# EAGLE design ModuleProcessing (EAGLE 9.1.3)
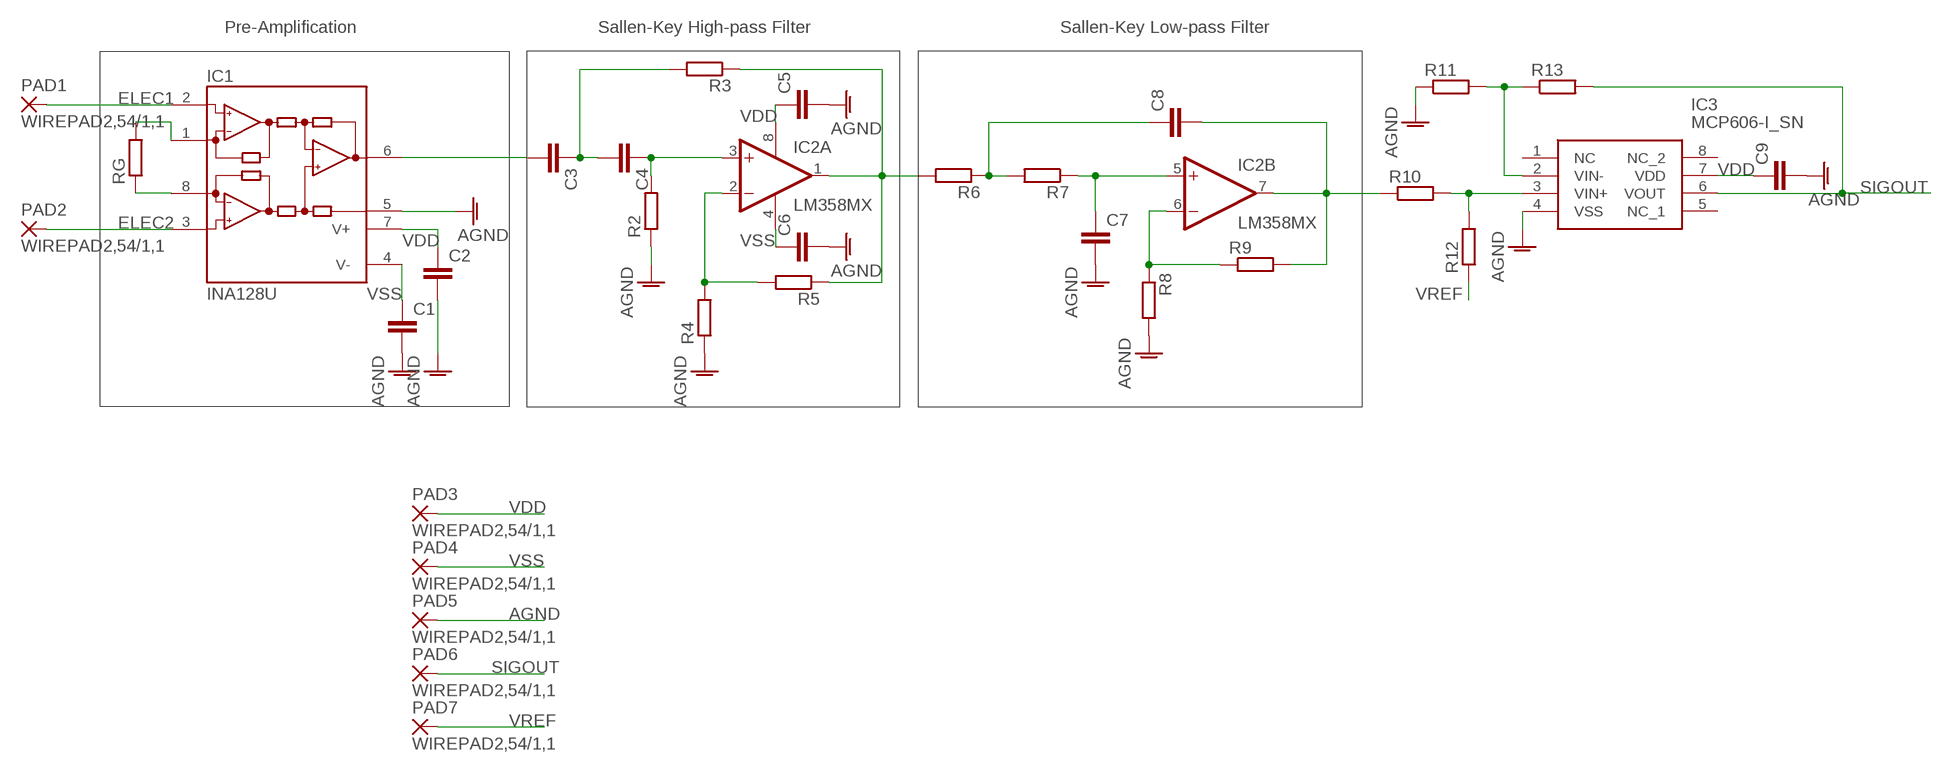
[diagram p0: schematic, sheet 1]

## Parts
C1  C-EUC0603  [C0603]
C2  C-EUC0603  [C0603]
C3  C-EUC0603  [C0603]
C4  C-EUC0603  [C0603]
C5  C-EUC0603  [C0603]
C6  C-EUC0603  [C0603]
C7  C-EUC0603  [C0603]
C8  C-EUC0603  [C0603]
C9  C-EUC0603  [C0603]
IC1  INA128U  [SO08]
IC2  LM358MX  [SO08]
IC3  MCP606-I_SN  [SOIC127P600X175-8N]
PAD1  WIREPAD2,54/1,1  [2,54/1,1]
PAD2  WIREPAD2,54/1,1  [2,54/1,1]
PAD3  WIREPAD2,54/1,1  [2,54/1,1]
PAD4  WIREPAD2,54/1,1  [2,54/1,1]
PAD5  WIREPAD2,54/1,1  [2,54/1,1]
PAD6  WIREPAD2,54/1,1  [2,54/1,1]
PAD7  WIREPAD2,54/1,1  [2,54/1,1]
R2  R-EU_0207/10  [0207/10]
R3  R-EU_0207/10  [0207/10]
R4  R-EU_0207/10  [0207/10]
R5  R-EU_0207/10  [0207/10]
R6  R-EU_0207/10  [0207/10]
R7  R-EU_0207/10  [0207/10]
R8  R-EU_0207/10  [0207/10]
R9  R-EU_0207/10  [0207/10]
R10  R-EU_0207/10  [0207/10]
R11  R-EU_0207/10  [0207/10]
R12  R-EU_0207/10  [0207/10]
R13  R-EU_0207/10  [0207/10]
RG  R-EU_0207/10  [0207/10]

## Nets
AGND: C1.2 C2.2 C5.2 C6.2 C7.2 C9.2 IC1.5(REF) IC3.4(VSS) PAD5.1(P) R2.1 R4.1 R8.2 R11.1
ELEC1: IC1.2(-IN) PAD1.1(P)
ELEC2: IC1.3(+IN) PAD2.1(P)
N$1: IC1.1(RG) RG.2
N$2: IC1.8(RG) RG.1
N$3: IC2.2(A:-IN) R4.2 R5.2
N$4: IC2.1(A:OUT) R3.1 R5.1 R6.2
N$5: C4.1 IC2.3(A:+IN) R2.2
N$6: C3.1 C4.2 R3.2
N$7: C3.2 IC1.6(OUT)
N$8: C8.1 R6.1 R7.2
N$9: C7.1 IC2.5(B:+IN) R7.1
N$10: C8.2 IC2.7(B:OUT) R9.2 R10.1
N$11: IC2.6(B:-IN) R8.1 R9.1
N$12: IC3.3(VIN+) R10.2 R12.2
N$13: IC3.2(VIN-) R11.2 R13.1
SIGOUT: IC3.6(VOUT) PAD6.1(P) R13.2
VDD: C2.1 C5.1 C9.1 IC1.7(V+) IC2.8(P:V+) IC3.7(VDD) PAD3.1(P)
VREF: PAD7.1(P) R12.1
VSS: C1.1 C6.1 IC1.4(V-) IC2.4(P:V-) PAD4.1(P)
Unconnected: IC3.1(NC) IC3.5(NC_1) IC3.8(NC_2)

## Notes on the sheet
- Pre-Amplification | Sallen-Key High-pass Filter | Sallen-Key Low-pass Filter

## Library data of the parts
C1-C9 = rcl:C-EU: CAPACITOR, European symbol; SPICEPREFIX: C
IC1 = burr-brown:INA128: Instrumentation Amplifiers Precision, Low Power; MF: TEXAS INSTRUMENTS; MPN: INA128U; OC_FARNELL: 1212413; OC_NEWARK: 35C1729
IC2 = linear:LM358: OP AMP also LM158; LM258; LM2904 Source: http://cache.national.com/ds/LM/LM158.pdf; SPICEPREFIX: J
IC3 = MCP606-I_SN:MCP606-I_SN: Single 25uA,2.5V Op Amp,MCP606-I/SN Source: Datasheet <http://ww1.microchip.com/downloads/en/DeviceDoc/11177f.pdf>; ALLIED_NUMBER: 70046173; ALLIED_PRICE-STOCK: http://www.alliedelec.com/microchip-technology-inc-mcp606-i-sn/70046173/; ARROW_PART_NUMBER: MCP606-I/SN; ARROW_PRICE-STOCK: https://www.arrow.com/en/products/mcp606-isn/microchip-technology; DESCRIPTION: Single 25uA,2.5V Op Amp,MCP606-I/SN; HEIGHT: 1.75mm; MANUFACTURER_NAME: Microchip; MANUFACTURER_PART_NUMBER: MCP606-I/SN; RS_PART_NUMBER: 0403002P; RS_PRICE-STOCK: http://uk.rs-online.com/web/p/products/0403002P
PAD1-PAD7 = wirepad:WIREPAD: Wire PAD connect wire on PCB
R2-R13 RG = rcl:R-EU_: RESISTOR, European symbol; SPICEPREFIX: R

## Net classes
0 default: width 0.406 mm, drill 0.559 mm, clearance 0.254 mm

## Board
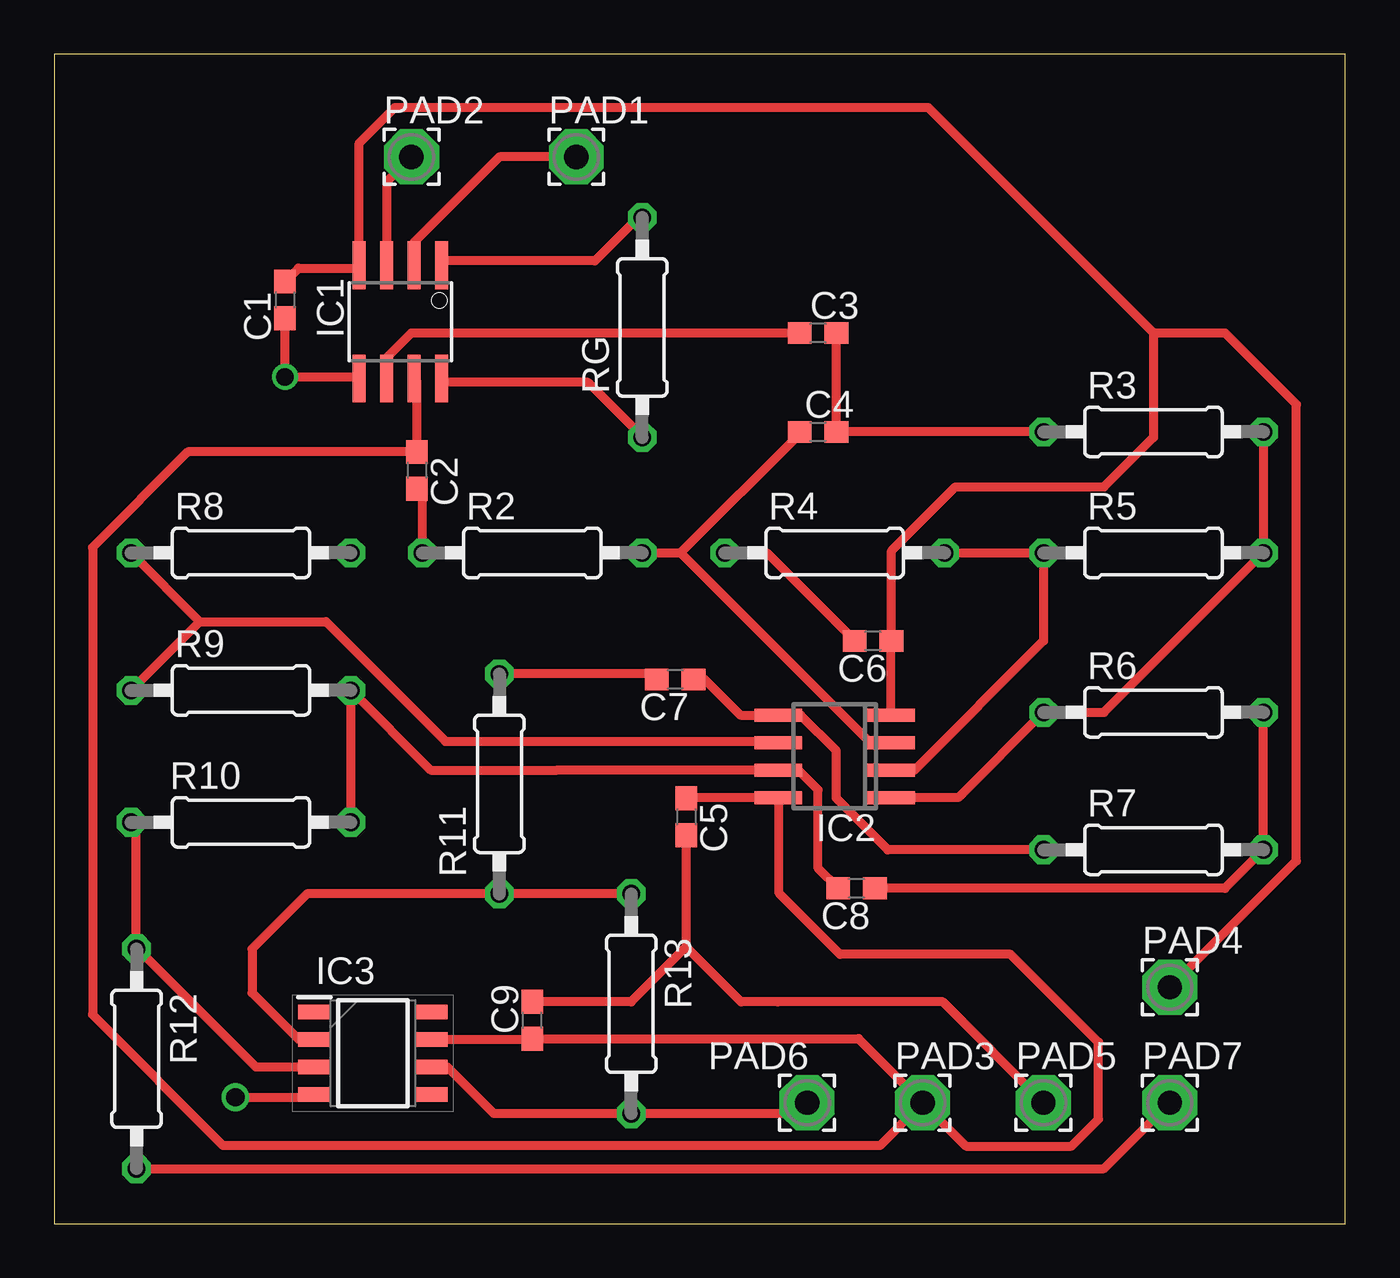
[diagram p1: board, top side]
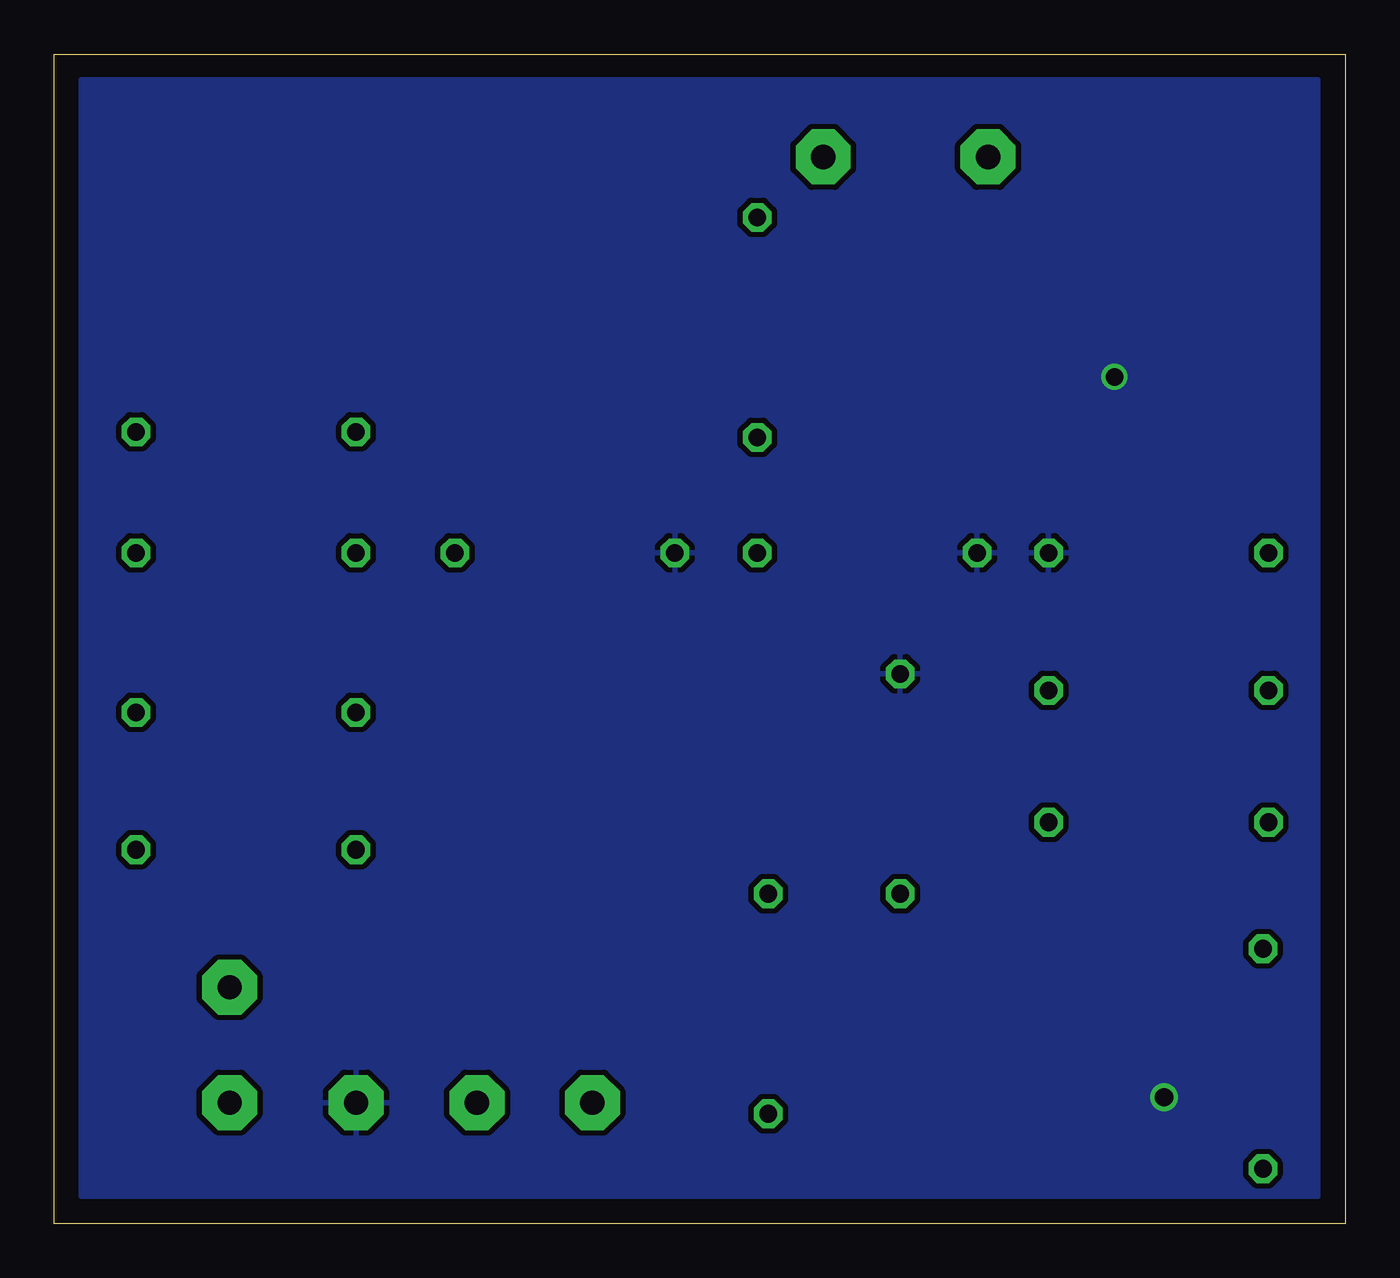
[diagram p2: board, bottom side, seen from below]

Size 59.67 x 54.03 mm. Coordinates in mm from the lower left corner, seen from the top.
Outline: 0,0 59.67,0 59.67,54.03 0,54.03 0,0
Copper layers (1*16): Top 0.035mm / dielectric 1.5mm / Bottom 0.035mm
Design rules "default": minimum track width 6mil, minimum drill 0.35mm, track to track 6mil, track to pad 6mil, pad to pad 6mil, via to via 6mil, smd to smd 6mil, copper to edge 40mil, drill to drill 6mil, minimum pad ring 10mil, minimum via ring 8mil, stop-mask expansion 4mil, vias tented up to drill 0mil, thermal gap 10mil

### Footprints (pad centres in the part's own frame; a part is rotated, then mirrored left to right if it is on the bottom)
C0603 = smd 1.1 x 1: 1 -0.85,0; 2 0.85,0
SO08 = smd 0.61 x 2.21: 1 -1.905,-2.616; 2 -0.635,-2.616; 3 0.635,-2.616; 4 1.905,-2.616; 5 1.905,2.616; 6 0.635,2.616; 7 -0.635,2.616; 8 -1.905,2.616
SO08' = smd 0.6 x 2.2: 1 -1.905,-2.6; 2 -0.635,-2.6; 3 0.635,-2.6; 4 1.905,-2.6; 5 1.905,2.6; 6 0.635,2.6; 7 -0.635,2.6; 8 -1.905,2.6
SOIC127P600X175-8N = smd 1.5 x 0.65: 1 -2.7,1.905; 2 -2.7,0.635; 3 -2.7,-0.635; 4 -2.7,-1.905; 5 2.7,-1.905; 6 2.7,-0.635; 7 2.7,0.635; 8 2.7,1.905
2,54/1,1 = drill 1.118 pad 2.54 octagon: 1 0,0
0207/10 = drill 0.813 octagon: 1 -5.08,0; 2 5.08,0

### Placement (x,y rotation side)
C1  10.67,42.67 270 top
C2  16.76,34.8 270 top
C3  35.31,41.15 180 top
C4  35.31,36.58 0 top
C5  29.21,18.8 270 top
C6  37.85,26.92 180 top
C7  28.7,25.15 180 top
C8  37.08,15.49 180 top
C9  22.1,9.4 90 top
IC1  16,41.66 180 top
IC2  LM358MX  [SO08']  36.07,21.59 90 top
IC3  14.73,7.87 0 top
PAD1  24.13,49.28 0 top
PAD2  16.51,49.28 0 top
PAD3  40.13,5.59 0 top
PAD4  51.56,10.92 0 top
PAD5  45.72,5.59 0 top
PAD6  34.8,5.59 0 top
PAD7  51.56,5.59 0 top
R2  22.1,30.99 0 top
R3  50.8,36.58 180 top
R4  36.07,30.99 0 top
R5  50.8,30.99 180 top
R6  50.8,23.62 180 top
R7  50.8,17.27 0 top
R8  8.64,30.99 0 top
R9  8.64,24.64 0 top
R10  8.64,18.54 180 top
R11  20.57,20.32 270 top
R12  3.81,7.62 90 top
R13  26.67,10.16 270 top
RG  27.18,41.4 90 top

### Tracks (layer width: path | path; a pad name or v marks a point on that pad's centre or on a via)
AGND  (via drill 0.8, 0.85)
  Top 0.406: 12.29,5.92 IC3.4 11.96,5.92 11.89,5.84 v8.38,5.84 | 36.99,26.9 C6.2 32.93,30.99 R4.1 | 27.74,25.17 C7.2 27.6,25.4 R11.1 | 10.69,41.53 C1.2 v10.67,39.12 14.02,39.12 IC1.5 | 13.46,31.01 R8.2 | PAD5.1 41.06,10.25 33.44,10.25 31.75,10.25 29.21,12.79 | C9.2 26.67,10.25 29.21,12.79 | C5.2 29.21,12.79 | R2.1 17.02,33.69 C2.2
  pour Bottom: 1.27,1.27 58.42,1.27 58.42,52.83 1.27,52.83
ELEC1
  Top 0.406: 16.74,44.56 16.74,44.48 IC1.2 16.64,45.34 20.57,49.28 PAD1.1
ELEC2
  Top 0.406: PAD2.1 15.37,48.13 IC1.3
N$1
  Top 0.406: IC1.1 18.06,44.48 24.99,44.48 26.98,46.46 RG.2
N$2
  Top 0.406: IC1.8 18.06,38.86 24.66,38.86 26.98,36.55 RG.1
N$3
  Top 0.406: 39.78,20.95 38.79,20.95 | 38.79,20.95 IC2.2 38.46,20.95 | 38.79,20.95 39.75,20.95 45.72,26.92 R5.2 R4.2
N$4
  Top 0.406: R3.1 R5.1 48.51,23.62 R6.2 41.78,19.68 IC2.1
N$5
  Top 0.406: 38.46,22.28 IC2.3 37.72,22.23 28.96,30.99 | R2.2 28.96,30.99 | 28.96,30.99 34.46,36.49 C4.1
N$6
  Top 0.406: R3.2 C4.2 C3.1
N$7
  Top 0.406: 15.42,38.2 15.42,38.86 IC1.6 15.37,40.01 16.51,41.15 C3.2
N$8
  Top 0.406: C8.1 54.1,15.49 R7.2 R6.1
N$9
  Top 0.406: 33.17,23.6 IC2.5 | 45.47,16.99 R7.1 38.53,17.27 36.14,19.65 36.14,21.84 34.49,23.5 IC2.5 | IC2.5 31.71,23.5 30.06,25.15 C7.1
N$10
  Top 0.406: 33.17,20.95 IC2.7 | C8.2 35.31,16.42 35.31,20.04 34.39,20.95 IC2.7 | IC2.7 23.24,20.95 17.4,20.95 R9.2 R10.1
N$11
  Top 0.406: IC2.6 33.17,22.28 18.09,22.28 12.56,27.8 12.55,27.81 6.73,27.81 | R8.1 6.73,27.81 | R9.1 6.73,27.81
N$12
  Top 0.406: IC3.3 11.96,7.24 9.32,7.24 3.86,12.7 R12.2 3.79,12.7 3.79,18.31 R10.2
N$13
  Top 0.406: R13.1 R11.2 11.68,15.24 9.14,12.7 9.14,10.67 11.3,8.51 IC3.2
SIGOUT
  Top 0.406: IC3.6 18.16,7.24 20.32,5.08 R13.2 34.29,5.08 PAD6.1
VDD
  Top 0.406: 33.17,19.63 IC2.8 | IC2.8 33.5,19.63 33.5,15.27 36.32,12.45 44.2,12.45 48.26,8.38 48.26,4.83 47.02,3.58 42.14,3.58 PAD3.1 | PAD3.1 38.15,3.61 7.82,3.61 1.78,9.65 1.78,31.24 6.18,35.65 C2.1 | IC3.7 22.06,8.51 C9.1 37.17,8.55 PAD3.1 | C2.1 16.89,35.6 | IC2.8 29.25,19.68 C5.1 | C2.1 16.76,38.91 IC1.7
VREF
  Top 0.406: R12.1 48.51,2.54 PAD7.1
VSS
  Top 0.406: 38.46,23.6 IC2.4 | 38.79,23.6 IC2.4 | IC2.4 38.67,26.9 C6.1 38.7,31.08 41.66,34.04 48.51,34.04 50.8,36.32 50.8,41.15 | PAD4.1 57.4,16.76 57.4,37.85 54.1,41.15 50.8,41.15 | 50.8,41.15 40.39,51.56 15.75,51.56 14.1,49.91 IC1.4 14.1,44.15 11.29,44.15 C1.1